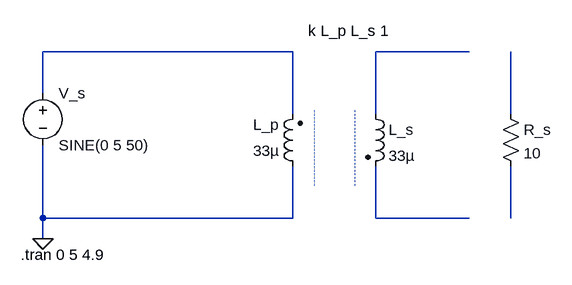
[diagram p0: schematic Transformer_Magnetic_Model.asc]
Transformer_Magnetic_Model.asc, the LTspice schematic file:
Version 4
SHEET 1 880 708
WIRE 208 256 -176 256
WIRE 480 256 336 256
WIRE -176 320 -176 256
WIRE 208 352 208 256
WIRE 336 352 336 256
WIRE 544 352 544 256
WIRE -176 512 -176 400
WIRE 208 512 208 432
WIRE 208 512 -176 512
WIRE 336 512 336 432
WIRE 480 512 336 512
WIRE 544 512 544 432
WIRE -176 544 -176 512
FLAG -176 544 0
SYMBOL voltage -176 304 R0
WINDOW 123 0 0 Left 0
WINDOW 39 0 0 Left 0
SYMATTR InstName V_s
SYMATTR Value SINE(0 5 50)
SYMBOL res 528 336 R0
SYMATTR InstName R_s
SYMATTR Value 10
SYMBOL ind2 224 448 R180
WINDOW 0 36 80 Left 2
WINDOW 3 36 40 Left 2
SYMATTR InstName L_p
SYMATTR Value 33µ
SYMATTR Type ind
SYMATTR SpiceLine Rser=1m
SYMBOL ind2 320 336 R0
SYMATTR InstName L_s
SYMATTR Value 33µ
SYMATTR Type ind
SYMATTR SpiceLine Rser=1m
TEXT 232 224 Left 2 !k L_p L_s 1
TEXT 240 464 VLeft 1 ;----------------------\n \n \n----------------------
TEXT -210 568 Left 2 !.tran 0 5 4.9

The netlist it stands for:
* Transformer_Magnetic_Model.asc
V_s N001 0 SINE(0 5 50)
R_s N003 N005 10
L_p 0 N001 33µ Rser=1m
L_s N002 N004 33µ Rser=1m
k L_p L_s 1
* ----------------------
* ----------------------
.tran 0 5 4.9
.backanno
.end